# EAGLE schematic led-cube (EAGLE 6.5.0)
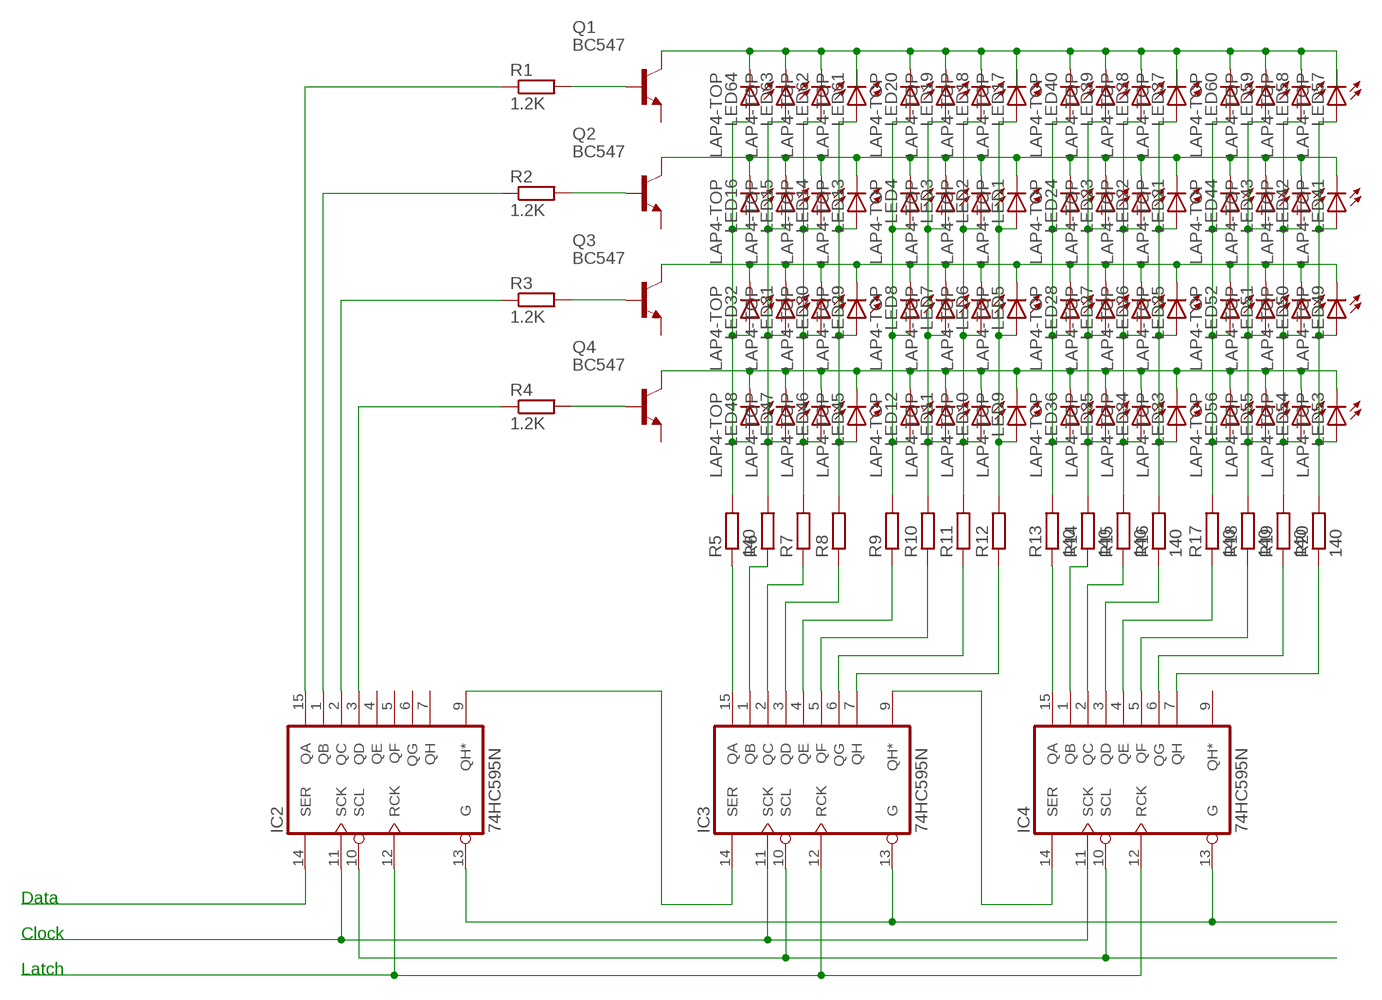
[diagram p0: schematic, sheet 1]

## Parts
IC2  74HC595N  [DIL16]
IC3  74HC595N  [DIL16]
IC4  74HC595N  [DIL16]
LED1  LAP4-TOP  [P47F-TOP]
LED2  LAP4-TOP  [P47F-TOP]
LED3  LAP4-TOP  [P47F-TOP]
LED4  LAP4-TOP  [P47F-TOP]
LED5  LAP4-TOP  [P47F-TOP]
LED6  LAP4-TOP  [P47F-TOP]
LED7  LAP4-TOP  [P47F-TOP]
LED8  LAP4-TOP  [P47F-TOP]
LED9  LAP4-TOP  [P47F-TOP]
LED10  LAP4-TOP  [P47F-TOP]
LED11  LAP4-TOP  [P47F-TOP]
LED12  LAP4-TOP  [P47F-TOP]
LED13  LAP4-TOP  [P47F-TOP]
LED14  LAP4-TOP  [P47F-TOP]
LED15  LAP4-TOP  [P47F-TOP]
LED16  LAP4-TOP  [P47F-TOP]
LED17  LAP4-TOP  [P47F-TOP]
LED18  LAP4-TOP  [P47F-TOP]
LED19  LAP4-TOP  [P47F-TOP]
LED20  LAP4-TOP  [P47F-TOP]
LED21  LAP4-TOP  [P47F-TOP]
LED22  LAP4-TOP  [P47F-TOP]
LED23  LAP4-TOP  [P47F-TOP]
LED24  LAP4-TOP  [P47F-TOP]
LED25  LAP4-TOP  [P47F-TOP]
LED26  LAP4-TOP  [P47F-TOP]
LED27  LAP4-TOP  [P47F-TOP]
LED28  LAP4-TOP  [P47F-TOP]
LED29  LAP4-TOP  [P47F-TOP]
LED30  LAP4-TOP  [P47F-TOP]
LED31  LAP4-TOP  [P47F-TOP]
LED32  LAP4-TOP  [P47F-TOP]
LED33  LAP4-TOP  [P47F-TOP]
LED34  LAP4-TOP  [P47F-TOP]
LED35  LAP4-TOP  [P47F-TOP]
LED36  LAP4-TOP  [P47F-TOP]
LED37  LAP4-TOP  [P47F-TOP]
LED38  LAP4-TOP  [P47F-TOP]
LED39  LAP4-TOP  [P47F-TOP]
LED40  LAP4-TOP  [P47F-TOP]
LED41  LAP4-TOP  [P47F-TOP]
LED42  LAP4-TOP  [P47F-TOP]
LED43  LAP4-TOP  [P47F-TOP]
LED44  LAP4-TOP  [P47F-TOP]
LED45  LAP4-TOP  [P47F-TOP]
LED46  LAP4-TOP  [P47F-TOP]
LED47  LAP4-TOP  [P47F-TOP]
LED48  LAP4-TOP  [P47F-TOP]
LED49  LAP4-TOP  [P47F-TOP]
LED50  LAP4-TOP  [P47F-TOP]
LED51  LAP4-TOP  [P47F-TOP]
LED52  LAP4-TOP  [P47F-TOP]
LED53  LAP4-TOP  [P47F-TOP]
LED54  LAP4-TOP  [P47F-TOP]
LED55  LAP4-TOP  [P47F-TOP]
LED56  LAP4-TOP  [P47F-TOP]
LED57  LAP4-TOP  [P47F-TOP]
LED58  LAP4-TOP  [P47F-TOP]
LED59  LAP4-TOP  [P47F-TOP]
LED60  LAP4-TOP  [P47F-TOP]
LED61  LAP4-TOP  [P47F-TOP]
LED62  LAP4-TOP  [P47F-TOP]
LED63  LAP4-TOP  [P47F-TOP]
LED64  LAP4-TOP  [P47F-TOP]
Q1  BC547  [TO92]
Q2  BC547  [TO92]
Q3  BC547  [TO92]
Q4  BC547  [TO92]
R1  1.2K  R-EU_0207/10  [0207/10]
R2  1.2K  R-EU_0207/10  [0207/10]
R3  1.2K  R-EU_0207/10  [0207/10]
R4  1.2K  R-EU_0207/10  [0207/10]
R5  140  R-EU_0207/10  [0207/10]
R6  R-EU_0207/10  [0207/10]
R7  R-EU_0207/10  [0207/10]
R8  R-EU_0207/10  [0207/10]
R9  R-EU_0207/10  [0207/10]
R10  R-EU_0207/10  [0207/10]
R11  R-EU_0207/10  [0207/10]
R12  R-EU_0207/10  [0207/10]
R13  140  R-EU_0207/10  [0207/10]
R14  140  R-EU_0207/10  [0207/10]
R15  140  R-EU_0207/10  [0207/10]
R16  140  R-EU_0207/10  [0207/10]
R17  140  R-EU_0207/10  [0207/10]
R18  140  R-EU_0207/10  [0207/10]
R19  140  R-EU_0207/10  [0207/10]
R20  140  R-EU_0207/10  [0207/10]

## Nets
N$1: LED18.C LED19.C LED20.C LED38.C LED39.C LED40.C LED58.C LED59.C LED60.C LED62.C LED63.C LED64.C Q1.3(C)
N$2: LED1.C LED2.C LED3.C LED4.C LED13.C LED14.C LED15.C LED16.C LED21.C LED22.C LED23.C LED24.C LED41.C LED42.C LED43.C LED44.C Q2.3(C)
N$3: LED5.C LED6.C LED7.C LED8.C LED25.C LED26.C LED27.C LED28.C LED29.C LED30.C LED31.C LED32.C LED49.C LED50.C LED51.C LED52.C Q3.3(C)
N$4: LED9.C LED10.C LED11.C LED12.C LED33.C LED34.C LED35.C LED36.C LED45.C LED46.C LED47.C LED48.C LED53.C LED54.C LED55.C LED56.C Q4.3(C)
N$5: LED16.A LED32.A LED48.A LED64.A R5.2
N$6: LED15.A LED31.A LED47.A LED63.A
N$7: LED14.A LED30.A LED46.A LED62.A
N$8: LED13.A LED29.A LED45.A LED61.A
N$9: Q1.2(B) R1.2
N$10: Q2.2(B) R2.2
N$11: Q3.2(B) R3.2
N$12: Q4.2(B) R4.2
N$13: IC3.15(QA) R5.1
N$14: IC4.15(QA) R13.1
N$15: IC2.15(QA) R1.1
N$16: IC2.1(QB) R2.1
N$17: IC2.2(QC) R3.1
N$18: IC2.3(QD) R4.1
N$19: IC3.1(QB) R6.1
N$20: IC3.2(QC) R7.1
N$25: LED4.A LED8.A LED12.A LED20.A
N$26: LED3.A LED7.A LED11.A LED19.A
N$27: LED2.A LED6.A LED10.A LED18.A
N$28: LED1.A LED5.A LED9.A LED17.A
N$33: LED24.A LED28.A LED36.A LED40.A
N$34: LED23.A LED27.A LED35.A LED39.A
N$35: LED22.A LED26.A LED34.A LED38.A
N$36: LED21.A LED25.A LED33.A LED37.A
N$41: LED44.A LED52.A LED56.A LED60.A
N$42: LED43.A LED51.A LED55.A LED59.A
N$43: LED42.A LED50.A LED54.A LED58.A
N$44: LED41.A LED49.A LED53.A LED57.A
N$45: IC3.3(QD) R8.1
N$46: IC3.4(QE) R9.1
N$47: IC3.5(QF) R10.1
N$48: IC3.6(QG) R11.1
N$49: IC3.7(QH) R12.1
N$50: IC4.1(QB) R14.1
N$51: IC4.2(QC) R15.1
N$52: IC4.3(QD) R16.1
N$53: IC4.4(QE) R17.1
N$54: IC4.5(QF) R18.1
N$55: IC4.6(QG) R19.1
N$56: IC4.7(QH) R20.1
N$57: IC2.14(SER)
N$58: IC2.9(QH*) IC3.14(SER)
N$59: IC3.9(QH*) IC4.14(SER)
N$60: IC2.11(SCK) IC3.11(SCK) IC4.11(SCK)
N$61: IC2.12(RCK) IC3.12(RCK) IC4.12(RCK)
N$62: IC2.13(G) IC3.13(G) IC4.13(G)
N$63: IC2.10(SCL) IC3.10(SCL) IC4.10(SCL)
Unconnected: IC2.4(QE) IC2.5(QF) IC2.6(QG) IC2.7(QH) IC4.9(QH*) LED17.C LED37.C LED57.C LED61.C Q1.1(E) Q2.1(E) Q3.1(E) Q4.1(E) R6.2 R7.2 R8.2 R9.2 R10.2 R11.2 R12.2 R13.2 R14.2 R15.2 R16.2 R17.2 R18.2 R19.2 R20.2

## Notes on the sheet
- Data
- Clock
- Latch

## Power pins joined to a net without a drawn wire
GND: IC2.8(GND) IC3.8(GND) IC4.8(GND)
VCC: IC2.16(VCC) IC3.16(VCC) IC4.16(VCC)

## Library data of the parts
IC2-IC4 = 74xx-eu:74*595: 8-bit SHIFT REGISTER, output latch
LED1-LED64 = led:*P4: PointLED® Enhanced Thinfilm LED TOP & BOTTOM mount LS P47F, LR P47F, LA P47F, LY P47F, LT P4SG, LB P4SG, LW P4SG Source: http://catalog.osram-os.com .. LA_LR_LS_LY_P47F_Pb_free.pdf
Q1-Q4 = transistor-npn:BC547*: NPN Transistor
R1-R20 = resistor:R-EU_: RESISTOR, European symbol